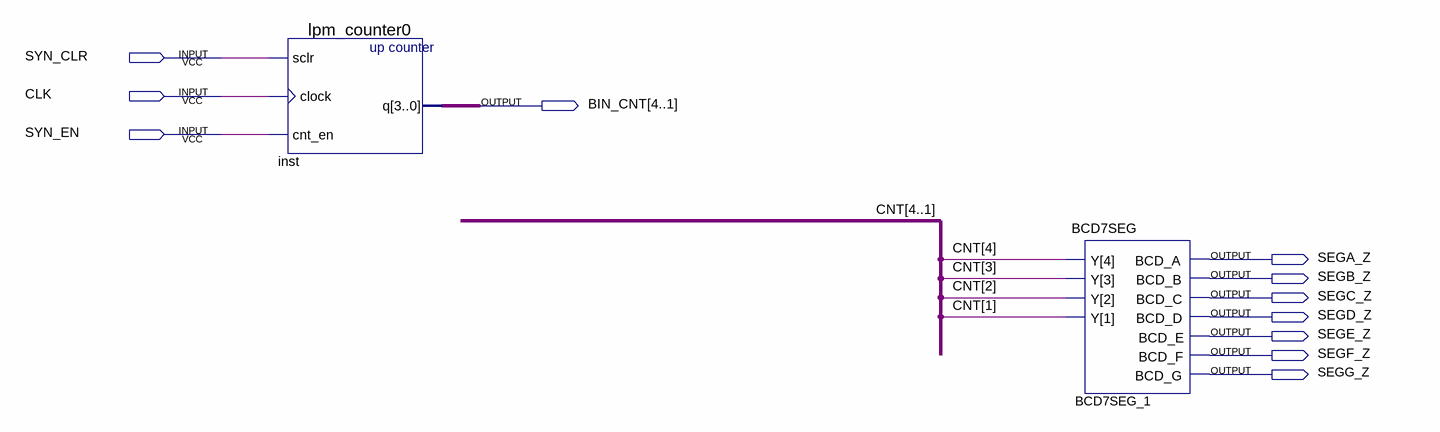
[diagram p0: schematic sheet]
// Quartus schematic tutorial3.bdf as structural Verilog: 2 symbols, 11 pins
module tutorial3 (
  input  SYN_CLR,
  input  CLK,
  input  SYN_EN,
  output [4:1] BIN_CNT,
  output SEGA_Z,
  output SEGB_Z,
  output SEGC_Z,
  output SEGD_Z,
  output SEGE_Z,
  output SEGF_Z,
  output SEGG_Z
);

  wire [4:1] CNT;

  lpm_counter0 inst (.sclr(SYN_CLR), .clock(CLK), .cnt_en(SYN_EN), .q(BIN_CNT));
  BCD7SEG BCD7SEG_1 (
    .Y(CNT), .BCD_A(SEGA_Z), .BCD_B(SEGB_Z), .BCD_C(SEGC_Z), .BCD_D(SEGD_Z), .BCD_E(SEGE_Z), .BCD_F(SEGF_Z),
    .BCD_G(SEGG_Z));
endmodule
